# EasyEDA schematic Shield_WDT.json
TITLE: F:\Amir Design\PCB_Design\EASYEDA JLBPCB\projects\Shield_WDT; REV: 0.1; Date: 2025-06-17; Sheet: 1/1; Company: Amir BS
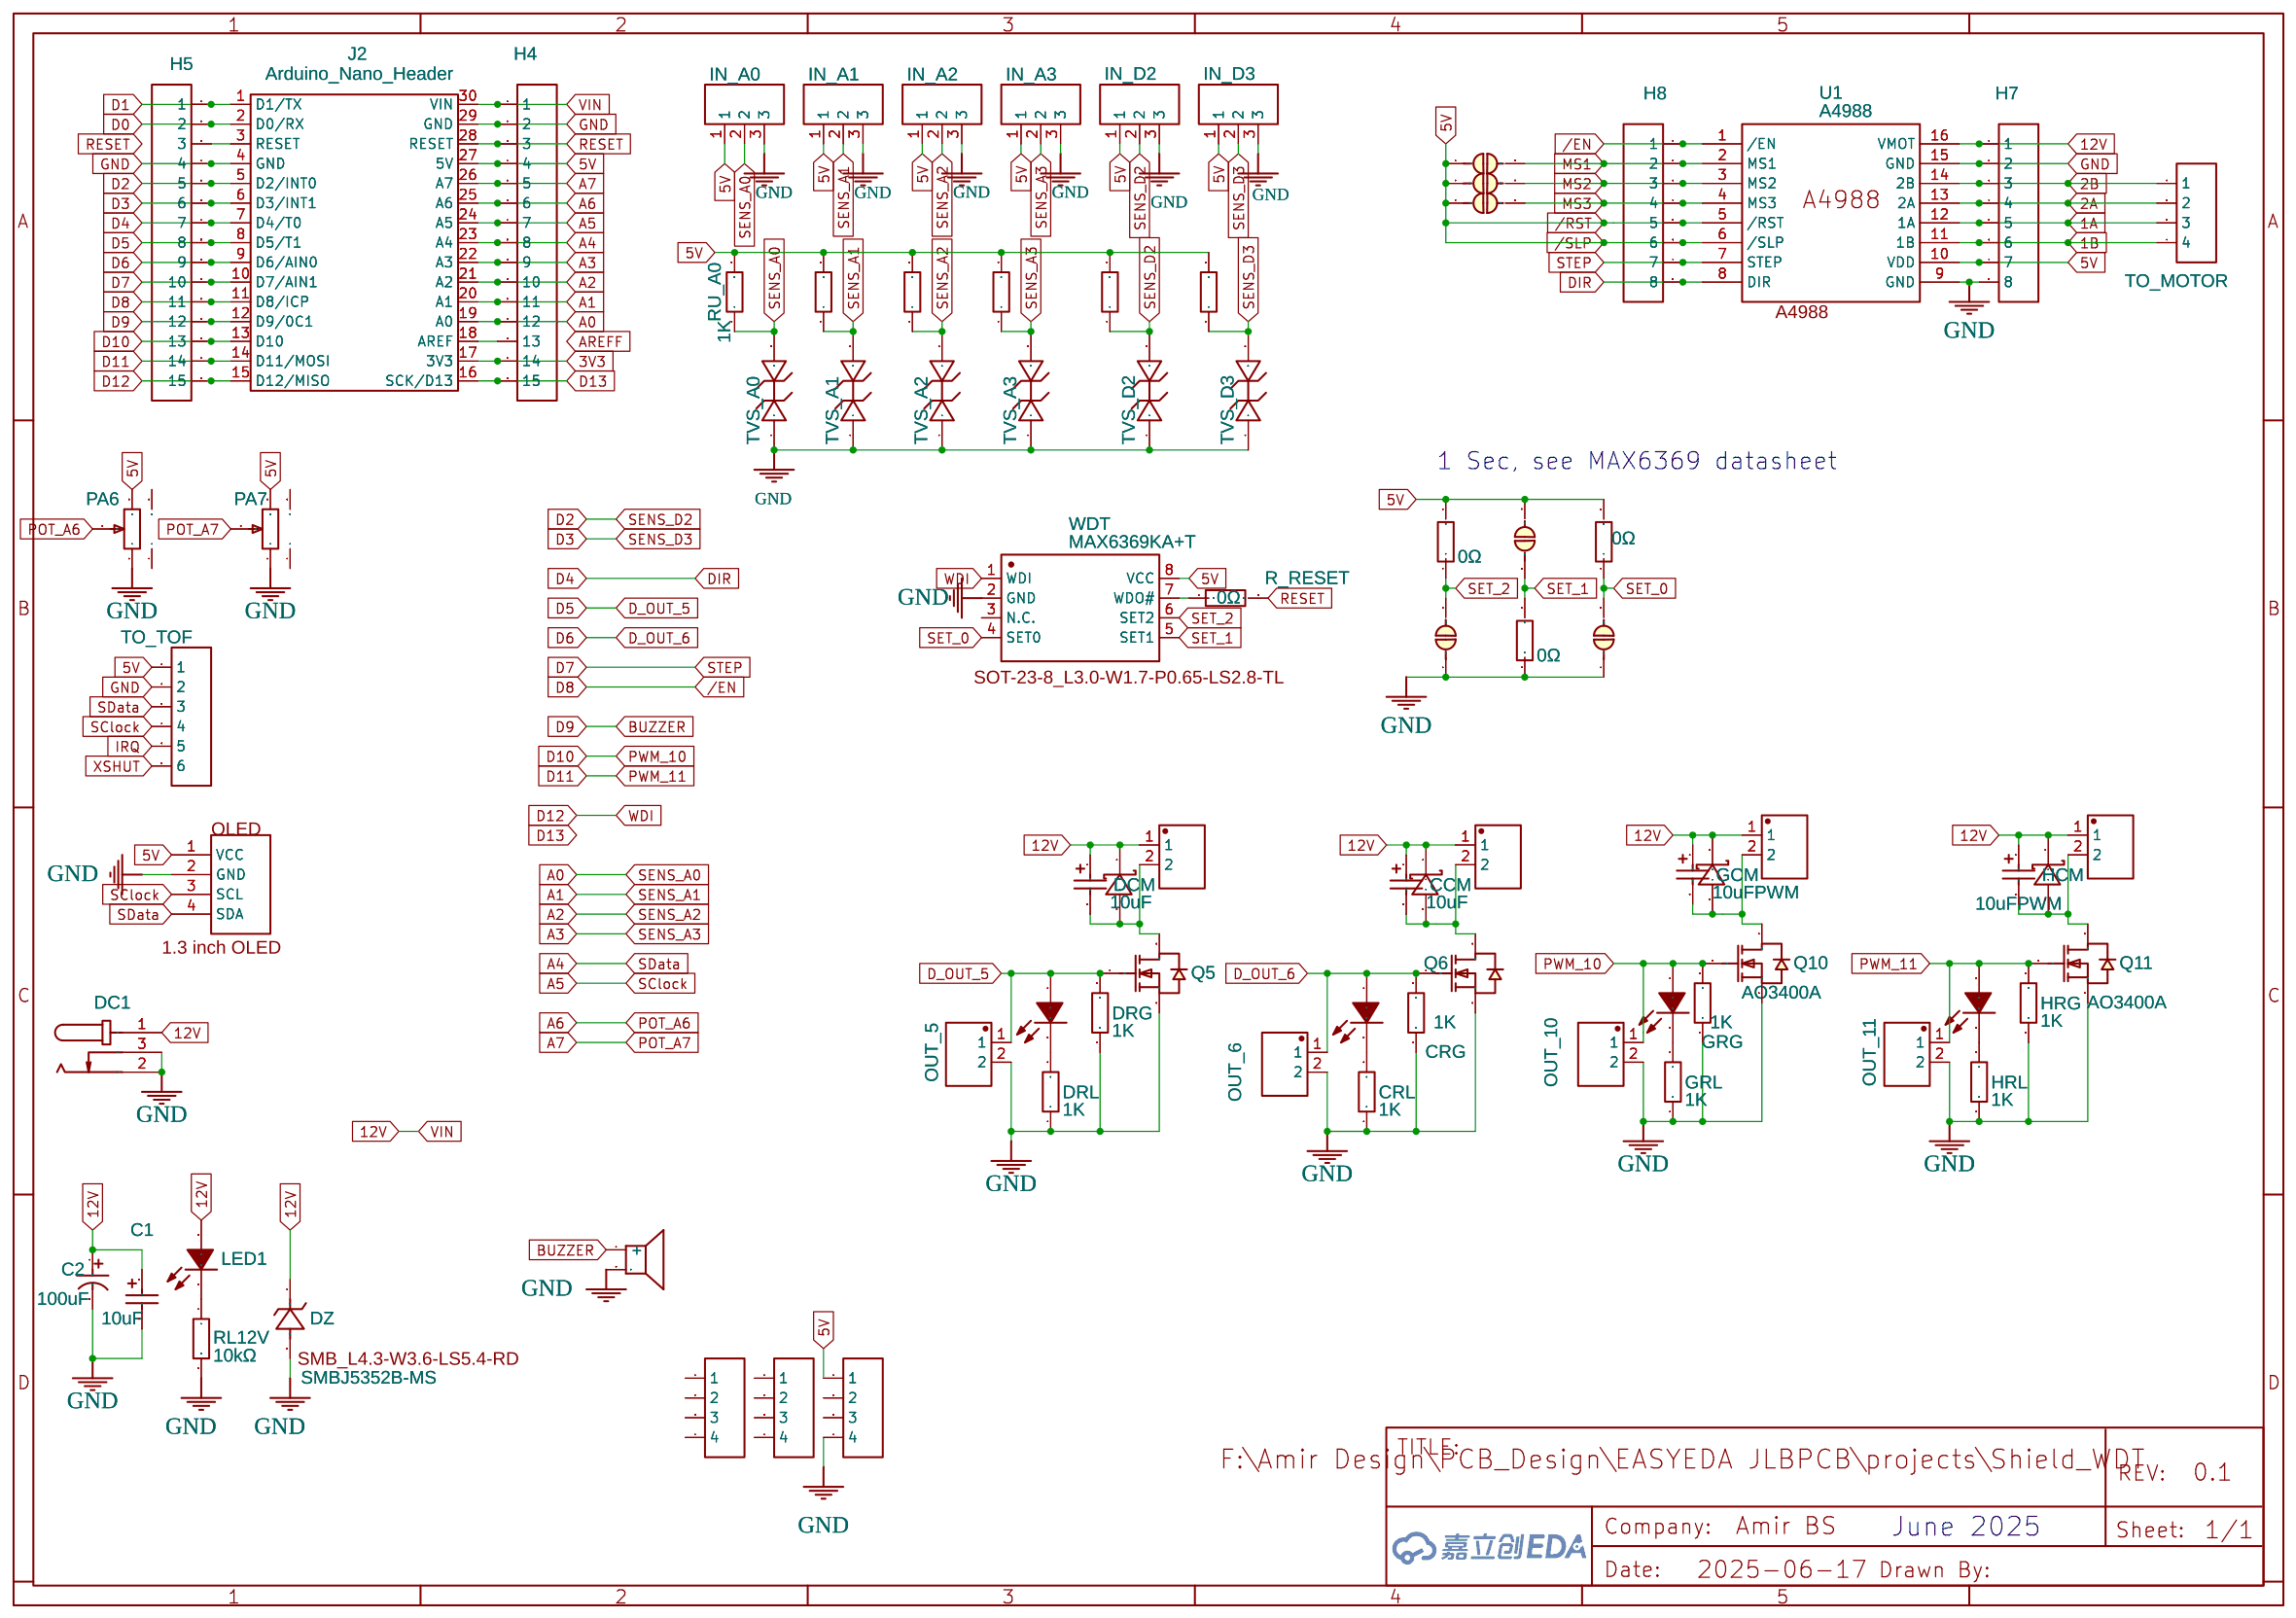
[diagram p0: schematic sheet]

## Parts
BUZZER1  BUZZER-12X9  [BUZ-TH_BD12.0-P7.60-D0.6-FD]
C1  10uF  [CAP-SMD_L3.2-W1.6-RD-C7171]
C2  100uF  [CAP-TH_BD6.3-P2.50-D1.0-FD]
CCM  10uF  [CAP-SMD_L3.2-W1.6-RD-C7171]
CCON  KF2510-2A  [CONN-TH_KF2510-2A]
CRG  1K  [R0603]
CRL  1K  [R0603]
D5  1N5819WS  [SOD-323_L1.8-W1.3-LS2.5-RD]
D6  1N5819WS  [SOD-323_L1.8-W1.3-LS2.5-RD]
D10  1N5819WS  [SOD-323_L1.8-W1.3-LS2.5-RD]
D11  1N5819WS  [SOD-323_L1.8-W1.3-LS2.5-RD]
DC1  DC  [DC-IN-TH_DC005]
DCM  10uF  [CAP-SMD_L3.2-W1.6-RD-C7171]
DCON  KF2510-2A  [CONN-TH_KF2510-2A]
DRG  1K  [R0603]
DRL  1K  [R0603]
DZ  SMBJ5352B-MS  [SMB_L4.3-W3.6-LS5.4-RD]
GCM  10uFPWM  [CAP-SMD_L3.2-W1.6-RD-C7171]
GCON  KF2510-2A  [CONN-TH_KF2510-2A]
GRG  1K  [R0603]
GRL  1K  [R0603]
H1  HDR-F-2.54_1x4  [HDR-F-2.54_1X4]
H2  HDR-F-2.54_1x4  [HDR-F-2.54_1X4]
H3  HDR-F-2.54_1x4  [HDR-F-2.54_1X4]
H4  HDR-F-2.54_1x15  [HDR-F-2.54_1X15]
H5  HDR-F-2.54_1x15  [HDR-F-2.54_1X15]
H7  HDR-F-2.54_1x8  [HDR-F-2.54_1X8]
H8  HDR-F-2.54_1x8  [HDR-F-2.54_1X8]
HCM  10uFPWM  [CAP-SMD_L3.2-W1.6-RD-C7171]
HCON  KF2510-2A  [CONN-TH_KF2510-2A]
HRG  1K  [R0603]
HRL  1K  [R0603]
IN_A0  FK2510  [CONN-TH_3P-P2.00_KF2510_3A]
IN_A1  FK2510  [CONN-TH_3P-P2.00_KF2510_3A]
IN_A2  FK2510  [CONN-TH_3P-P2.00_KF2510_3A]
IN_A3  FK2510  [CONN-TH_3P-P2.00_KF2510_3A]
IN_D2  FK2510  [CONN-TH_3P-P2.00_KF2510_3A]
IN_D3  FK2510  [CONN-TH_3P-P2.00_KF2510_3A]
J2  Arduino_Nano_Header  [DIP-30_L43.18-W15.24-ARDUINONANO]
J_S0  J_SET0  [JUMPERS_SMT-JUMPER_2_NC_PASTE_NO-SILK]
J_S1  J_SET1  [JUMPERS_SMT-JUMPER_2_NC_PASTE_NO-SILK]
J_S2  J_SET_2  [JUMPERS_SMT-JUMPER_2_NC_PASTE_NO-SILK]
JP1  JUMPER-SMT_2  [JUMPERS_SMT-JUMPER_2_NC_PASTE_NO-SILK]
JP2  JUMPER-SMT_2  [JUMPERS_SMT-JUMPER_2_NC_PASTE_NO-SILK]
JP3  JUMPER-SMT_2  [JUMPERS_SMT-JUMPER_2_NC_PASTE_NO-SILK]
LED1  KT-0603R  [LED0603-RD]
LED5  0603White light_C2290  [LED0603-R-RD_WHITE]
LED6  0603White light_C2290  [LED0603-R-RD_WHITE]
LED10  0603White light_C2290  [LED0603-R-RD_WHITE]
LED11  0603White light_C2290  [LED0603-R-RD_WHITE]
OLED  OLED_1_3_NO_HOLES  [OLED_1_3_NO_HOLES]
OUT_5  KF2510-2A  [CONN-TH_KF2510-2A]
OUT_6  KF2510-2A  [CONN-TH_KF2510-2A]
OUT_10  KF2510-2A  [CONN-TH_KF2510-2A]
OUT_11  KF2510-2A  [CONN-TH_KF2510-2A]
PA6  长柄旋转电位器  [RES-ADJ-TH_RV09]
PA7  长柄旋转电位器  [RES-ADJ-TH_RV09]
Q5  AO3400A  [SOT-23-3_L2.9-W1.3-P1.90-LS2.4-BR]
Q6  AO3400A  [SOT-23-3_L2.9-W1.3-P1.90-LS2.4-BR]
Q10  AO3400A  [SOT-23-3_L2.9-W1.3-P1.90-LS2.4-BR]
Q11  AO3400A  [SOT-23-3_L2.9-W1.3-P1.90-LS2.4-BR]
R_RESET  0Ω  [R0402]
R_S0  0Ω  [R0402]
R_S1  0Ω  [R0402]
R_S2  0Ω  [R0402]
RL12V  10kΩ  [R0603]
RU_A0  1K  [R0603]
RU_A1  1K  [R0603]
RU_A2  1K  [R0603]
RU_A3  1K  [R0603]
RU_D2  1K  [R0603]
RU_D3  1K  [R0603]
TO_MOTOR  HDR-F-2.54_1x4  [HDR-F-2.54_1X4]
TO_TOF  HDR-F-2.54_1x6  [HDR-F-2.54_1X6]
TVS_A0  TVSS5VCES-02GP-J  [SOD-523_L1.2-W0.8-LS1.6-BI]
TVS_A1  TVSS5VCES-02GP-J  [SOD-523_L1.2-W0.8-LS1.6-BI]
TVS_A2  TVSS5VCES-02GP-J  [SOD-523_L1.2-W0.8-LS1.6-BI]
TVS_A3  TVSS5VCES-02GP-J  [SOD-523_L1.2-W0.8-LS1.6-BI]
TVS_D2  TVSS5VCES-02GP-J  [SOD-523_L1.2-W0.8-LS1.6-BI]
TVS_D3  TVSS5VCES-02GP-J  [SOD-523_L1.2-W0.8-LS1.6-BI]
U1  A4988  [A4988]
WDT  MAX6369KA+T  [SOT-23-8_L3.0-W1.7-P0.65-LS2.8-TL]

## Library data of the parts
BUZZER1 = BUZZER-12X9: Contributor: lcsc; Supplier: LCSC; Supplier Part: C9900016920; Manufacturer: null; JLCPCB Part Class: Extended Part; Package Display: No
C1 = TAJA106K016RNJ: Supplier: LCSC; Manufacturer: Kyocera AVX; Supplier Part: C7171; JLCPCB Part Class: Basic Part; Package Display: No
C2 = 100uF 35V 6.3*11: Supplier: LCSC; Manufacturer: CX(承兴); Supplier Part: C19504; JLCPCB Part Class: Extended Part; Package Display: No
CCM DCM GCM HCM = TAJA106K016RNJ: JLCPCB Part Class: Basic Part; Package Display: No
CCON DCON GCON HCON OUT_5 OUT_6 OUT_10 OUT_11 = KF2510-2A: Supplier: LCSC; Manufacturer: BOOMELE; Supplier Part: C27543; JLCPCB Part Class: Extended Part; Package Display: No
CRG CRL DRG DRL GRG GRL HRG HRL RU_A0-RU_A3 RU_D2 RU_D3 = 0603WAF1001T5E: Supplier: LCSC; Manufacturer: UniOhm; Supplier Part: C21190; JLCPCB Part Class: Basic Part; Package Display: No
D5 D6 D10 D11 = 1N5819WS: Contributor: LCSC; Supplier: LCSC; Supplier Part: C191023; Manufacturer: Hottech(合科泰); JLCPCB Part Class: Basic Part; Package Display: No
DC1 = DC005-2.0MM: Supplier: LCSC; Manufacturer: SOFNG; Supplier Part: C111567; Package Display: No
DZ = SMBJ5352B-MS: Supplier: LCSC; Supplier Part: C18547759; Manufacturer: MSKSEMI(美森科); JLCPCB Part Class: Extended Part; Contributor: lcsc; Package Display: Yes
H1-H3 TO_MOTOR = HDR-F-2.54_1x4: Supplier Part: C225501; Supplier: LCSC; Contributor: LCEDA_Lib; Package Display: No
H4 H5 = HDR-F-2.54_1x15: Supplier Part: C124408; Supplier: LCSC; Contributor: LCEDA_Lib; Package Display: No
H7 H8 = HDR-F-2.54_1x8: Supplier Part: C225505; Supplier: LCSC; Contributor: LCEDA_Lib; Package Display: No
IN_A0-IN_A3 IN_D2 IN_D3 = kf2510_3A: JLCPCB Part Class: Extended Part; Package Display: No
J2 = Arduino_Nano_Header
J_S0-J_S2 JP1-JP3 = JUMPER-SMT_2: Contributor: P-Thomsen; Package Display: No
LED1 = KT-0603R: Supplier: LCSC; Manufacturer: KENTO; Supplier Part: C2286; JLCPCB Part Class: Basic Part; Package Display: No
LED5 LED6 LED10 LED11 = 0603White light_C2290: Supplier: LCSC; Manufacturer: KENTO; Supplier Part: C2290; JLCPCB Part Class: Basic Part; Package Display: No
OLED = OLED_1_3_NO_HOLES: Contributor: amirb; Package Display: No
PA6 PA7 = 长柄旋转电位器: Supplier: LCSC; Supplier Part: C2874842; Manufacturer: null; JLCPCB Part Class: Extended Part; Contributor: LCSC; Package Display: No
Q5 Q6 Q10 Q11 = AO3400A: Supplier: LCSC; Manufacturer: AOS; Supplier Part: C20917; JLCPCB Part Class: Basic Part; Package Display: No
R_RESET R_S0-R_S2 = 0402WGF0000TCE: Supplier: LCSC; Manufacturer: UniOhm; Supplier Part: C17168; Resistance (Ohms): 0; JLCPCB Part Class: Basic Part; Package Display: No
RL12V = 0603WAF1002T5E: Supplier: LCSC; Manufacturer: UNI-ROYAL(厚声); Supplier Part: C25804; Resistance (Ohms): 10K; JLCPCB Part Class: Basic Part; Package Display: No
TO_TOF = HDR-F-2.54_1x6: Supplier Part: C40877; Supplier: LCSC; Contributor: LCEDA_Lib; Package Display: No
TVS_A0-TVS_A3 TVS_D2 TVS_D3 = TVSS5VCES-02GP-J: Contributor: LCSC; Supplier: LCSC; Supplier Part: C355254; Manufacturer: SINO-IC(光宇睿芯); JLCPCB Part Class: Extended Part; Package Display: No
U1 = A4988: Contributor: unaja_closp; Package Display: Yes
WDT = MAX6369KA+T: Supplier: LCSC; Manufacturer: ADI(亚德诺)/MAXIM(美信); Supplier Part: C128613; JLCPCB Part Class: Extended Part; Package Display: Yes

## Nets
3V3: H4.14 J2.17(3V3)
12V: C1.1 C2.1 CCM.1 CCON.1 D5.1(K) D6.1(K) D10.1(K) D11.1(K) DC1.1 DCM.1 DCON.1 DZ.1(K) GCM.1 GCON.1 H4.1 H7.1 HCM.1 HCON.1 J2.30(VIN) LED1.2(A) U1.16(VMOT)
GND: BUZZER1.2 C1.2 C2.2 CRG.1 CRL.1 DC1.2 DC1.3 DRG.1 DRL.1 DZ.2(A) GRG.1 GRL.1 H3.4 H4.2 H5.4 H7.2 H7.8 HRG.1 HRL.1 IN_A0.3 IN_A1.3 IN_A2.3 IN_A3.3 IN_D2.3 IN_D3.3 J2.4(GND) J2.29(GND) J_S0.1 J_S2.1 OLED.2(GND) OUT_5.2 OUT_6.2 OUT_10.2 OUT_11.2 PA6.1 PA7.1 Q5.2(S) Q6.2(S) Q10.2(S) Q11.2(S) R_S1.1 RL12V.2 TO_TOF.2 TVS_A0.1 TVS_A1.1 TVS_A2.1 TVS_A3.1 TVS_D2.1 TVS_D3.1 U1.9(GND) U1.15(GND) WDT.2(GND)
1A: H7.5 TO_MOTOR.3 U1.12(1A)
1B: H7.6 TO_MOTOR.4 U1.11(1B)
2A: H7.4 TO_MOTOR.2 U1.13(2A)
2B: H7.3 TO_MOTOR.1 U1.14(2B)
/EN: H5.11 H8.1 J2.11(D8/ICP) U1.1(/EN)
/RST: H3.1 H4.4 H7.7 H8.5 H8.6 IN_A0.1 IN_A1.1 IN_A2.1 IN_A3.1 IN_D2.1 IN_D3.1 J2.27(5V) J_S1.2 JP1.1 JP2.1 JP3.1 OLED.1(VCC) PA6.3 PA7.3 R_S0.2 R_S2.2 RU_A0.2 RU_A1.2 RU_A2.2 RU_A3.2 RU_D2.2 RU_D3.2 TO_TOF.1 U1.5(/RST) U1.6(/SLP) U1.10(VDD) WDT.8(VCC)
A0: H4.12 IN_A0.2 J2.19(A0) RU_A0.1 TVS_A0.2
A1: H4.11 IN_A1.2 J2.20(A1) RU_A1.1 TVS_A1.2
A2: H4.10 IN_A2.2 J2.21(A2) RU_A2.1 TVS_A2.2
A3: H4.9 IN_A3.2 J2.22(A3) RU_A3.1 TVS_A3.2
A4: H4.8 J2.23(A4) OLED.4(SDA) TO_TOF.3
A5: H4.7 J2.24(A5) OLED.3(SCL) TO_TOF.4
A6: H4.6 J2.25(A6) PA6.2
A7: H4.5 J2.26(A7) PA7.2
BUZZER: BUZZER1.1(+) H5.12 J2.12(D9/0C1)
D0: H5.2 J2.2(D0/RX)
D1: H5.1 J2.1(D1/TX)
D2: H5.5 IN_D2.2 J2.5(D2/INT0) RU_D2.1 TVS_D2.2
D3: H5.6 IN_D3.2 J2.6(D3/INT1) RU_D3.1 TVS_D3.2
D4: H5.7 H8.8 J2.7(D4/T0) U1.8(DIR)
D5: DRG.2 H5.8 J2.8(D5/T1) LED5.1(A) OUT_5.1 Q5.1(G)
D6: CRG.2 H5.9 J2.9(D6/AIN0) LED6.1(A) OUT_6.1 Q6.1(G)
D7: H5.10 H8.7 J2.10(D7/AIN1) U1.7(STEP)
D10: GRG.2 H5.13 J2.13(D10) LED10.1(A) OUT_10.1 Q10.1(G)
D11: H5.14 HRG.2 J2.14(D11/MOSI) LED11.1(A) OUT_11.1 Q11.1(G)
D12: H5.15 J2.15(D12/MISO) WDT.1(WDI)
D13: H4.15 J2.16(SCK/D13)
IRQ: TO_TOF.5
MS1: H8.2 JP1.2 U1.2(MS1)
MS2: H8.3 JP2.2 U1.3(MS2)
MS3: H8.4 JP3.2 U1.4(MS3)
RESET: H4.3 J2.28(RESET) R_RESET.2
SET_0: J_S0.2 R_S0.1 WDT.4(SET0)
SET_1: J_S1.1 R_S1.2 WDT.5(SET1)
SET_2: J_S2.2 R_S2.1 WDT.6(SET2)
XSHUT: TO_TOF.6
Net-(CCM-2): CCM.2 CCON.2 D6.2(A) Q6.3(D)
Net-(CRL-2): CRL.2 LED6.2(K)
Net-(D5-2): D5.2(A) DCM.2 DCON.2 Q5.3(D)
Net-(D10-2): D10.2(A) GCM.2 GCON.2 Q10.3(D)
Net-(D11-2): D11.2(A) HCM.2 HCON.2 Q11.3(D)
Net-(DRL-2): DRL.2 LED5.2(K)
Net-(GRL-2): GRL.2 LED10.2(K)
Net-(H4-13): H4.13 J2.18(AREF)
Net-(H5-3): H5.3 J2.3(RESET)
Net-(HRL-2): HRL.2 LED11.2(K)
Net-(LED1-1): LED1.1(K) RL12V.1
Net-(R_RESET-1): R_RESET.1 WDT.7(WDO#)

Not connected (* = marked no-connect by the designer): H1 1 2 3 4; H2 1 2 3 4; H3 2 3; PA6 4 5; PA7 4 5; WDT 3(N.C.)

## Notes on the sheet
- 1 Sec, see MAX6369 datasheet
- June 2025
